# Altium schematic sheet EMG_Interface2.SchDoc
size A; SheetNumber: 1; SheetTotal: 1
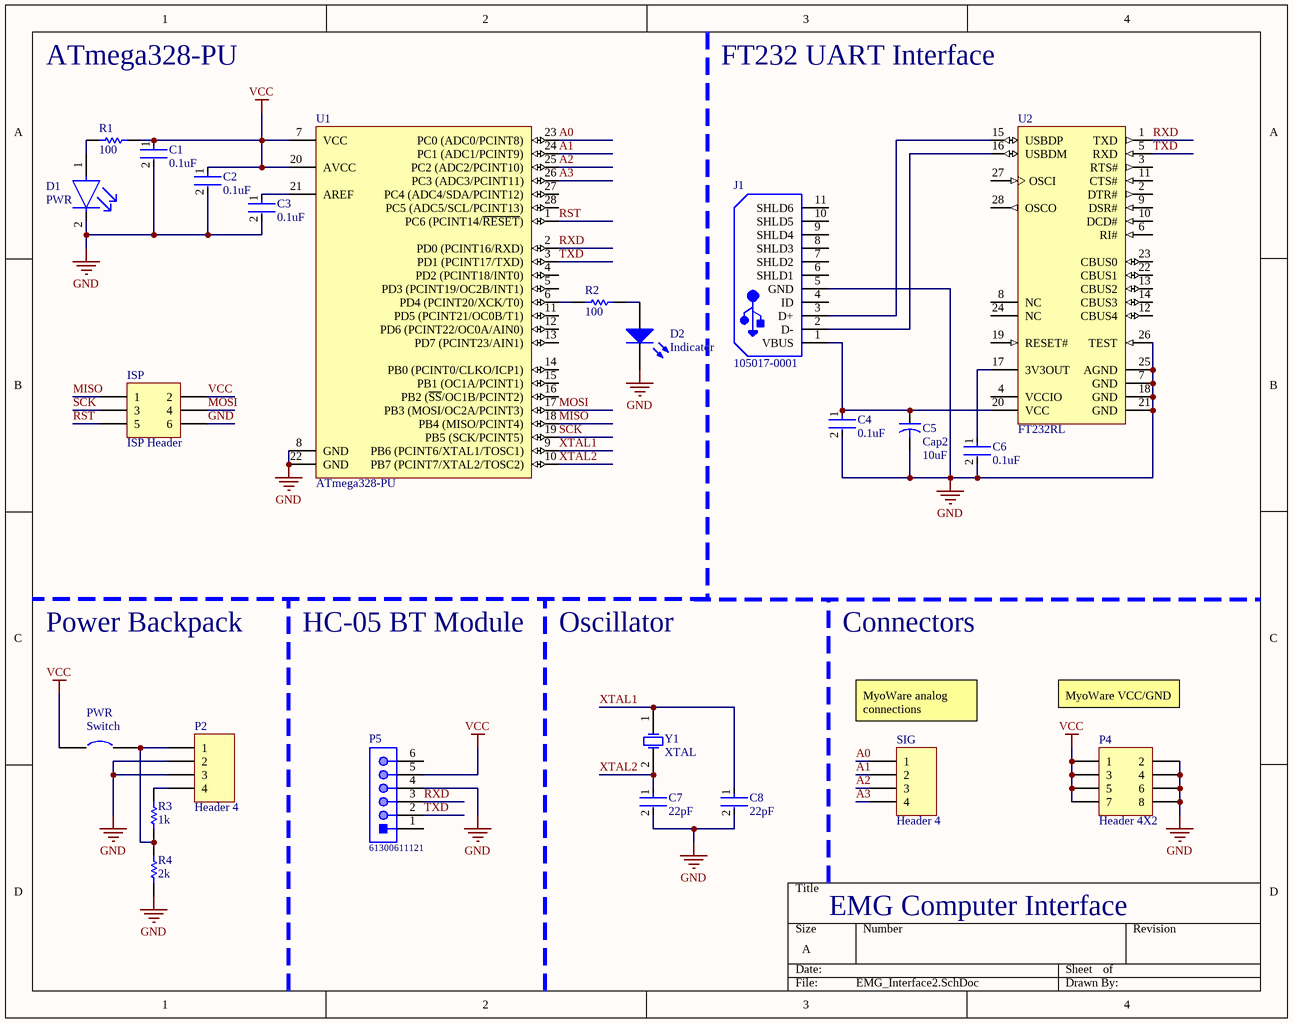
[diagram p0: EMG_Interface2.SchDoc]

## Parts
C1  0.1uF  [FP-1206-L_3_2_0_2-W_1_6_0-IPC_C]
C2  0.1uF  [FP-1206-L_3_2_0_2-W_1_6_0-IPC_C]
C3  0.1uF  [FP-1206-L_3_2_0_2-W_1_6_0-IPC_C]
C4  0.1uF  [FP-1206-L_3_2_0_2-W_1_6_0-IPC_C]
C5  Cap2  value 10uF  [CAPR5-4X5]
C6  0.1uF  [FP-1206-L_3_2_0_2-W_1_6_0-IPC_C]
C7  22pF  [FP-C1206C-EB-MFG]
C8  22pF  [FP-C1206C-EB-MFG]
D1  PWR  [FP-SML-LX1206GC-TR-MFG]
D2  Indicator  [1206_A]
ISP  ISP Header  [HDR2X3]
J1  105017-0001  [USB-MICRO-B_V]
P2  Header 4  [HDR1X4]
P4  Header 4X2  [HDR2X4]
P5  61300611121  [61300611121]
PWR  Switch  [SPST-2]
R1  100  [RESC3216X70X50LL05T20]
R2  100  [RESC3216X70X50LL05T20]
R3  1k  [RESC3216X70X50LL05T20]
R4  2k  [RESC3216X70X50NL05T20]
SIG  Header 4  [HDR1X4]
U1  ATmega328-PU  [28P3]
U2  FT232RL  [FTDI-SSOP-28_M]
Y1  XTAL  [R38]

## Nets
GND: C1.2 C2.2 C3.2 C4.2 C5.2 C6.2 C7.2 C8.2 D1.2(C) D2.1(K) ISP.6 J1.5(GND) P2.2 P2.3 P4.2 P4.4 P4.6 P4.8 P5.4 R4.1 U1.8(GND) U1.22(GND) U2.7(GND) U2.18(GND) U2.21(GND) U2.25(AGND) U2.26(TEST)
VCC: C1.1 C2.1 ISP.2 P4.1 P4.3 P4.5 P4.7 P5.5 PWR.1 R1.2 U1.7(VCC) U1.20(AVCC)
A0: SIG.1 U1.23(PC0_(ADC0/PCINT8))
A1: SIG.2 U1.24(PC1_(ADC1/PCINT9))
A2: SIG.3 U1.25(PC2_(ADC2/PCINT10))
A3: SIG.4 U1.26(PC3_(ADC3/PCINT11))
MISO: ISP.1 U1.18(PB4_(MISO/PCINT4))
MOSI: ISP.4 U1.17(PB3_(MOSI/OC2A/PCINT3))
RST: ISP.5 U1.1(PC6_(PCINT14/~{RESET}))
RXD: P5.3 U1.2(PD0_(PCINT16/RXD)) U2.1(TXD)
SCK: ISP.3 U1.19(PB5_(SCK/PCINT5))
TXD: P5.2 U1.3(PD1_(PCINT17/TXD)) U2.5(RXD)
XTAL1: C8.1 U1.9(PB6_(PCINT6/XTAL1/TOSC1)) Y1.1(OSC1)
XTAL2: C7.1 U1.10(PB7_(PCINT7/XTAL2/TOSC2)) Y1.2(OSC2)
NetC3_1: C3.1 U1.21(AREF)
NetC4_1: C4.1 C5.1 J1.1(VBUS) U2.20(VCC)
NetC6_1: C6.1 U2.17(3V3OUT)
NetD1_1: D1.1(A) R1.1
NetD2_2: D2.2(A) R2.2
NetJ1_2: J1.2(D-) U2.16(USBDM)
NetJ1_3: J1.3(D+) U2.15(USBDP)
NetP2_1: P2.1 PWR.2 R3.1 R4.2
NetP2_4: P2.4 R3.2
NetR2_1: R2.1 U1.6(PD4_(PCINT20/XCK/T0))

Not connected (* = marked no-connect by the designer): J1 4(ID) 6(SHLD1) 7(SHLD2) 8(SHLD3) 9(SHLD4) 10(SHLD5) 11(SHLD6); P5 1 6; U1 4(PD2_(PCINT18/INT0)) 5(PD3_(PCINT19/OC2B/INT1)) 11(PD5_(PCINT21/OC0B/T1)) 12(PD6_(PCINT22/OC0A/AIN0)) 13(PD7_(PCINT23/AIN1)) 14(PB0_(PCINT0/CLKO/ICP1)) 15(PB1_(OC1A/PCINT1)) 16(PB2_(~{SS}/OC1B/PCINT2)) 27(PC4_(ADC4/SDA/PCINT12)) 28(PC5_(ADC5/SCL/PCINT13)); U2 2(DTR#) 3(RTS#) 4(VCCIO) 6(RI#) 8(NC) 9(DSR#) 10(DCD#) 11(CTS#) 12(CBUS4) 13(CBUS2) 14(CBUS3) 19(RESET#) 22(CBUS1) 23(CBUS0) 24(NC) 27(OSCI) 28(OSCO)

## Notes on the sheet
- ATmega328-PU
- FT232 UART Interface
- Power Backpack
- HC-05 BT Module
- Oscillator
- Connectors
- MyoWare VCC/GND
- (near SIG) MyoWare analog connections
- EMG Computer Interface

## Library data of the parts
C1-C4 C6 = CMP-04427-013576-1: General Purpose Ceramic Capacitor, 1206, 100nF, 5%, X7R, 15%, 100V; Max Operating Temperature: 125°C; Depth: 1.6mm; Package Quantity: 1; Thickness: 0.05inch; Number of Pins: 2; Height: 1.27mm; Voltage Rating (DC): 100V; Radiation Hardening: No; Termination: SMD/SMT; Construction: Flat; REACH SVHC: No SVHC; Case/Package: 1206; Case Code (Imperial): 1206; Tolerance: 5%; Width: 0.063inch; Voltage: 100V; Packaging: Tape and Reel; Voltage Rating: 100V; Case Code (Metric): 3216; Capacitance: 100nF; Min Operating Temperature: -55°C; Length: 3.2mm; Dielectric: X7R; Mount: Surface Mount; Dielectric Material: Ceramic; Contact Plating: Tin; RoHS Compliant: Yes; Lead Free: Lead Free; Series: -
C5 = Cap2: Capacitor; Published: 23-Sep-2002; PackageReference: CAPR5-4X5; Publisher: Altium Limited; PackageDescription: Capacitor; 2 Leads
C7 C8 = CMP-1037-00978-2: 1206 22pF Ceramic Multilayer Capacitor; 50VDC; 125degC; C0G Dielec; +/-5% SMD; Manufacturer Part Number: C1206C220J5GACTU; Manufacturer: KEMET; Automotive Grade: Grade 0; Temperature Coefficient: 15%; Tolerance: 0.05; Voltage Rating: 50 V; Height: 0.88mm; Mouser Description: 1206 22pF Ceramic Multilayer Capacitor; 50VDC; 125degC; C0G Dielec; +/-5% SMD; Ipc Land Pattern Name: CAPC320160X78; Temperature Range High: +150°C; Automotive: Yes; Device Class L3: Ceramic Capacitors; ComponentLink2Description: Datasheet; Temperature: -55°C to +150°C; Lead Free: Yes; Category: Cap; Device Class L2: Capacitors; Device Class L1: Passive Components; Value: 22 pF; Capacitance: 22 pF; Digikey Description: 1206 22pF Ceramic Multilayer Capacitor; 50VDC; 125degC; C0G Dielec; +/-5% SMD; Octopart: https://octopart.com/c1206c220j5gactu-kemet-131912; Material: Ceramic; Temperature Characteristic: C0G; Package: C1206C-EB; RoHS: TRUE; ComponentLink2URL: https://content.kemet.com/datasheets/KEM_C1007_X8R_ULTRA_150C_SMD.pdf; Temperature Range Low: -55°C
D1 = CMP-2000-07122-2: LED GREEN CLEAR 1206 SMD; Test Current: 20mA; Luminous Intensity: 10mcd; Forward Voltage: 2.2V; Viewing Angle: 160°; Lens Color: Colorless; Approvals: UL; Dominant Wavelength: 565nm; Current Rating: 25mA; Number of LEDs: 1; Power Rating: 65mW; Lens Style: Rectangular; Length: 3.2mm; Mount: Surface Mount; Package Quantity: 1; Forward Current: 20mA; Case/Package: 1206; Lead Free: Lead Free; Case Code (Imperial): 1206; Max Operating Temperature: 85°C; REACH SVHC: No SVHC; RoHS Compliant: Yes; Number of Pins: 2; Illumination Color: Green; Width: 1.6mm; Packaging: Tape and Reel; Wavelength: 565nm; Lens Transparency: Clear; Height: 1.1mm; Color: Green; Min Operating Temperature: -40°C; Case Code (Metric): 3216
D2 = CMP-1426-00017-1: SMD mono-color Chip LED, WL-SMCW, Super Red; Manufacturer: Wuerth Elektronik; PartNumber: 150120SS75000; ComponentLink1URL: http://www.we-online.com; PackageReference: 1206_A; ComponentLink2Description: Datasheet; ComponentLink1Description: Manufacturer URL; ComponentLink2URL: http://katalog.we-online.com/led/datasheet/150120SS75000.pdf; Color: Super Red
ISP = Header 3X2: Header, 3-Pin, Dual row; LatestRevisionDate: 17-Jul-2002; LatestRevisionNote: Re-released for DXP Platform.; Publisher: Altium Limited
J1 = CMP-2000-05827-1: Micro-USB B Receptacle, Right Angle, Bottom Mount, Surface Mount, with Solder Tabs, -30 to 85 degC, 5-Pin USB, RoHS, Tape and Reel; Manufacturer: Molex; Featured Product: Micro-USBConnectorsUSBConnectors; Other Names: WM1399DKR; Package Version: Rev. F, 12/2012; Number of Contacts: 5; Connector Type: USB-microB; Catalog Drawings: 1050170001; 3D Model: 105017-0001.stp; Mating Products: WM17145-ND-CABLEMICROUSBBTOSTDA1.0MWM17147-ND-CABLEMICROUSBBTOSTDA2.0MWM17146-ND-CABLEMICROUSBBTOSTDA1.5M; PCN Assembly/Origin: ResinSupplier21/Oct/2015; Voltage - Max: 30V; Online Catalog: Molex-MicroUSB; Manufacturer URL: http://www.molex.com/; Package Description: 5-Leads USB, Micro B, Body 7.5 x 5 mm, Pitch 0.65 mm; Datasheet URL: http://www.molex.com/elqNow/elqRedir.htm?ref=http://www.molex.com/webdocs/datasheets/pdf/en-us/1050170001_IO_CONNECTORS.pdf; Ingress Protection: -; Datasheet Version: 03/2016; Mounting Type: BoardCutout,SurfaceMount,RightAngle; Circuits: 5; Standard Package: 1; Package Reference: MICRO-B; Package URL: http://www.molex.com/pdm_docs/sd/1050170001_sd.pdf; Category: Connectors,Interconnects; Series: -; RoHS Information: 1050170001CertofCompliance; Features: Shielded,SolderRetention; Family: USB,DVI,HDMIConnectors; Specifications: -; Gender: Receptacle; Packaging: Digi-Reel®; Mounting Technology: SurfaceMount
P2 SIG = Header 4: Header, 4-Pin; LatestRevisionDate: 17-Jul-2002; LatestRevisionNote: Re-released for DXP Platform.; Publisher: Altium Limited
P4 = Header 4X2: Header, 4-Pin, Dual row; LatestRevisionDate: 17-Jul-2002; LatestRevisionNote: Re-released for DXP Platform.; Publisher: Altium Limited
P5 = CMP-1502-01070-1: THT Vertical Pin Header WR-PHD, Pitch 2.54 mm, Single Row, 6 pins; Manufacturer: Wurth Elektronik; Gender: Male; Pin Number: 6; Pitch: 2.54mm; Working Voltage: 250VAC; Rated Current: 3A; Withstanding Voltage: 500VAC; Contact Resistance: 20mOhm; Operating Temperature: -40to105degC; Packaging: Bag; Datasheet URL: https://katalog.we-online.de/em/datasheet/6130xx11121.pdf; Package Reference: 61300611121; Mounting Technology: THT; Publisher: WurthElektronik; Part Number: 61300611121; Manufacturer URL: http://www.we-online.de; Row Number: Single; Orientation: Vertical
PWR = Circuit Breaker: Published: 24-Mar-1999; LatestRevisionDate: 17-Jul-2002; LatestRevisionNote: Re-released for DXP Platform.; PackageReference: SPST-2; Publisher: Altium Limited; PackageDescription: Switch; 2 Leads
R1 R2 = CMP-2003-00713-1: Part Number: ERJ-P08J101V; Manufacturer: Panasonic
R3 = CMP-2003-00017-1: Manufacturer: Panasonic; Part Number: ERJ-8ENF1001V
R4 = CMP-2003-00195-1: Part Number: ERJ-8ENF2001V; Manufacturer: Panasonic
U1 = CMP-0095-00015-2: 8-bit AVR Microcontroller, 32KB Flash, 1KB EEPROM, 2KB SRAM, 28-pin PDIP, Industrial Grade (-40°C to 85°C); ComponentLink3Description: ATmega48A/48PA/88A/88PA/168A/168PA/328/328P Summary; RevisionNote: DatasheetVersion updated. URLs added.; DatasheetVersion: revD, May-2011; ComponentLink1URL: http://www.atmel.com/; PackageVersion: revB, Sep-2001; PackageDescription: 28-lead (0.300"/7.62mm Wide) Plastic Dual Inline Package (PDIP); PackageReference: 28P3; ComponentLink1Description: Manufacturer URL; ComponentLink2Description: ATmega48A/48PA/88A/88PA/168A/168PA/328/328P Datasheet; ComponentLink3URL: http://www.atmel.com/dyn/resources/prod_documents/8271S.pdf; ComponentLink2URL: http://www.atmel.com/dyn/resources/prod_documents/8271.pdf
U2 = CMP-2000-05029-1: IC USB FS SERIAL UART 28-SSOP; Manufacturer: FTDI; Receive FIFO: 256B; Number of Channels per Chip: 1; Maximum Data Rate: 3MBd; Transmit FIFO: 128B; Dimensions: 10.2x5.3x1.75mm; Mounting Type: SurfaceMount; Height: 1.75mm; Package Type: SSOP; Datasheet Version: Rev. 1.04, 02/2006; Width: 5.3mm; Manufacturer URL: http://www.ftdichip.com/; Datasheet URL: http://datasheet.octopart.com/FT232RL-FTDI-datasheet-120501.pdf; Maximum Operating Temperature: +85degC; Minimum Operating Temperature: -40degC; Pin Count: 28; Length: 10.2mm
Y1 = XTAL: Crystal Oscillator; Published: 8-Jun-2000; LatestRevisionDate: 17-Jul-2002; LatestRevisionNote: Re-released for DXP Platform.; PackageReference: R38; Publisher: Altium Limited; PackageDescription: Crystal, Thru-Hole; 2 Leads; Body 3.1 x 8.2 mm (Dia.xH)